# EAGLE design dc-dc_-12V-1A_0_2 (EAGLE 6.1)
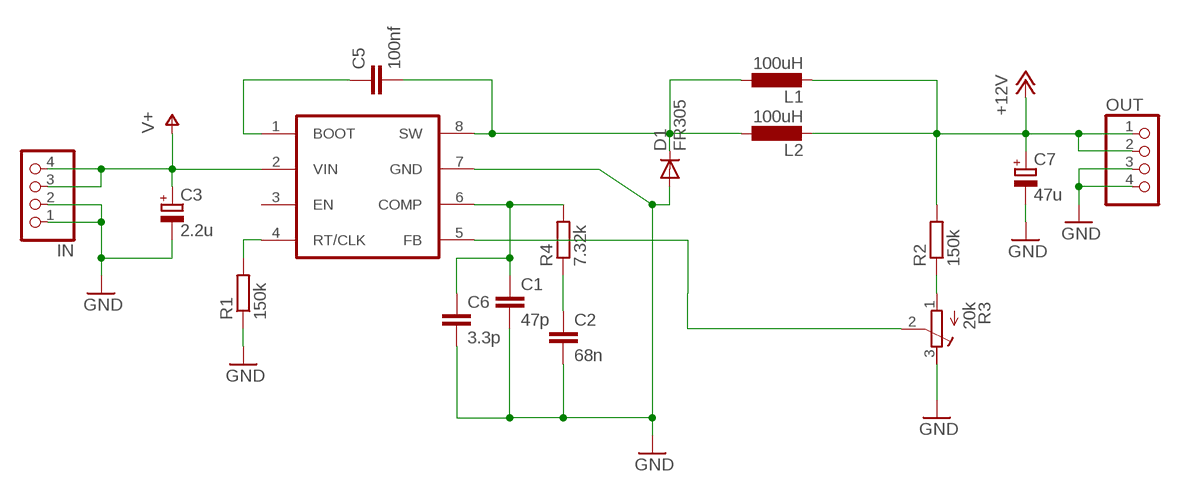
[diagram p0: schematic, sheet 1]

## Parts
C1  47p  C-EUC1206  [C1206]
C2  68n  C-EUC1206  [C1206]
C3  2.2u  CPOL-EUE2-4  [E2-4]
C5  100nf  C-EUC0805  [C0805]
C6  3.3p  C-EUC1206  [C1206]
C7  47u  CPOL-EUE2-4  [E2-4]
D1  FR305  1N5400  [DO201-15]
IN  PINHD-1X4  [1X04]
L1  100uH  RCL_L-EU6000-XXX-RC  [RCL_6000-XXXX-RC]
L2  100uH  RCL_L-EU6000-XXX-RC  [RCL_6000-XXXX-RC]
OUT  PINHD-1X4  [1X04]
R1  150k  R-EU_R0805  [R0805]
R2  150k  R-EU_R0805  [R0805]
R3  20k  R-TRIMM64X  [RTRIM64X]
R4  7.32k  R-EU_0204/5  [0204/5]
U1  TPS54560  [SO08-POWERPAD]

## Nets
+12V: C7.+ L1.2 L2.2 OUT.1 OUT.2 R2.2
GND: C1.2 C2.2 C3.- C6.2 C7.- D1.A IN.1 IN.2 OUT.3 OUT.4 R1.1 R3.3(A) U1.7(GND)
N$1: C5.1 U1.1(BOOT)
N$2: C5.2 D1.C L1.1 L2.1 U1.8(SW)
N$3: R2.1 R3.1(E)
N$4: R3.2(S) U1.5(FB)
N$5: C1.1 C6.1 R4.2 U1.6(COMP)
N$6: C2.1 R4.1
N$8: R1.2 U1.4(RT/CLK)
V+: C3.+ IN.3 IN.4 U1.2(VIN)
Unconnected: U1.3(EN)

## Library data of the parts
C1 C2 C5 C6 = rcl:C-EU: CAPACITOR, European symbol
C3 C7 = rcl:CPOL-EU: POLARIZED CAPACITOR, European symbol
D1 = diode:1N5400: DIODE standard rectifier, 3 A, 50 V (Motorola)
IN OUT = pinhead:PINHD-1X4: PIN HEADER
L1 L2 = Hangar:RCL_L-EU: INDUCTOR, European symbol
R1 R2 R4 = rcl:R-EU_: RESISTOR, European symbol
R3 = rcl:R-TRIMM: Trimm resistor
U1 = TPS54560:TPS54560

## Board
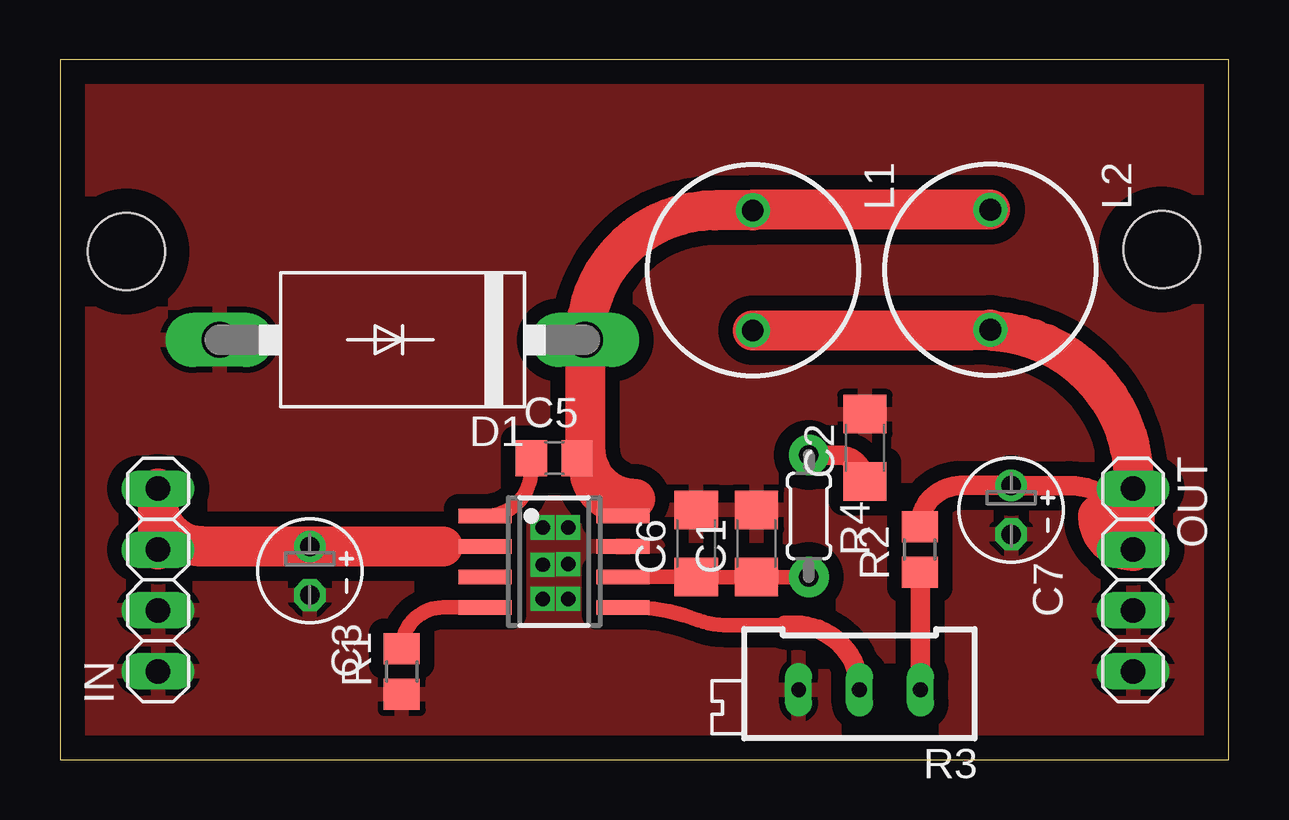
[diagram p1: board, top side]
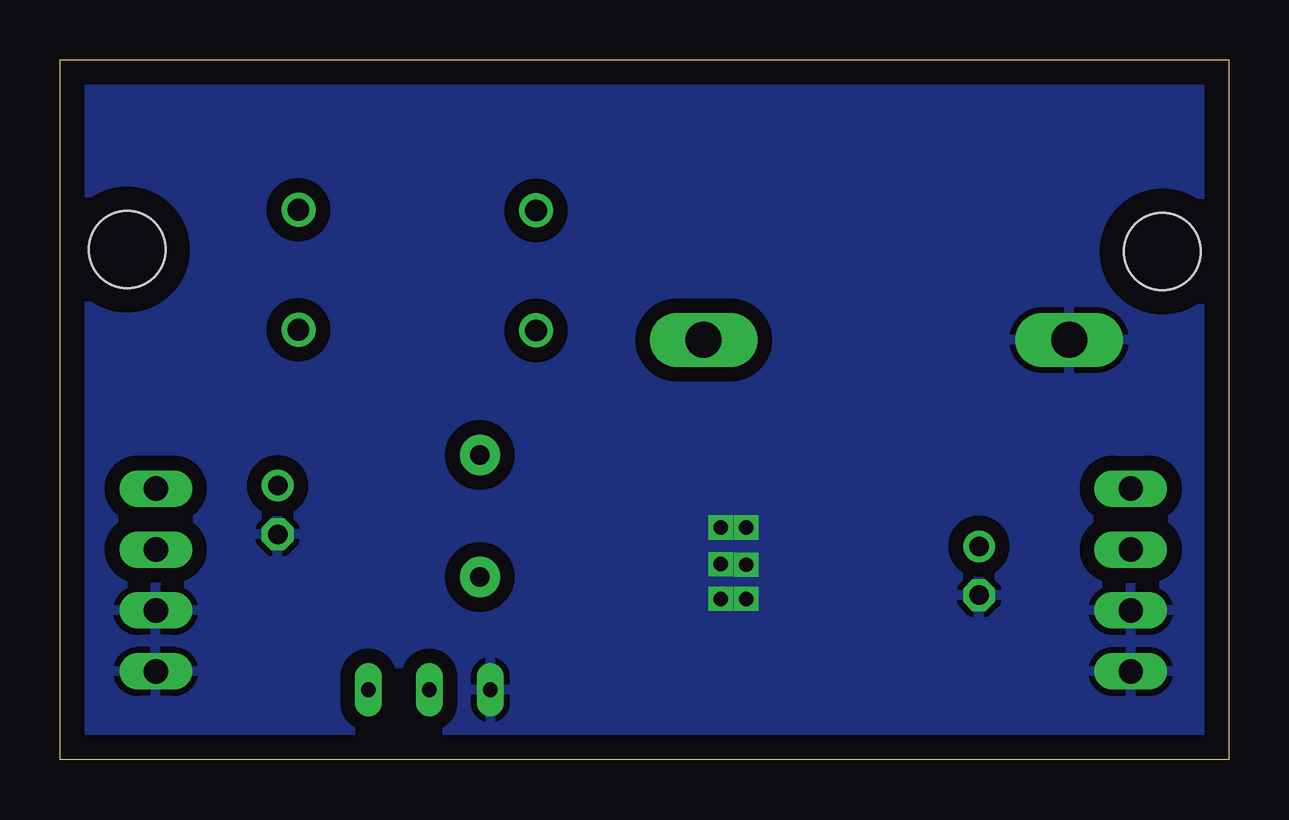
[diagram p2: board, bottom side, seen from below]

Size 48.72 x 29.16 mm. Coordinates in mm from the lower left corner, seen from the top.
Outline: 0,0 48.72,0 48.72,29.16 0,29.16 0,0
Copper layers (1*16): Top 0.035mm / dielectric 1.5mm / Bottom 0.035mm
Design rules: minimum track width 10mil, minimum drill 0.6mm, track to track 8mil, track to pad 8mil, pad to pad 8mil, via to via 8mil, smd to smd 8mil, copper to edge 40mil, drill to drill 8mil, minimum pad ring 10mil, minimum via ring 8mil, stop-mask expansion 4mil, vias tented up to drill 0mil, thermal gap 10mil
Holes 3.2 mm at 2.77,21.18 45.92,21.26

### Footprints (pad centres in the part's own frame; a part is rotated, then mirrored left to right if it is on the bottom)
C1206 = smd 1.6 x 1.8: 1 -1.4,0; 2 1.4,0
E2-4 = drill 0.813 pad 1.27: + -1.016,0 | drill 0.813 pad 1.27 octagon: - 1.016,0
C0805 = smd 1.3 x 1.5: 1 -0.95,0; 2 0.95,0
DO201-15 = drill 1.499 long: A 7.62,0; C -7.62,0
1X04 = drill 1.016 long: 1 -3.81,0; 2 -1.27,0; 3 1.27,0; 4 3.81,0
RCL_6000-XXXX-RC = drill 0.9 pad 1.422: 1 -2.5,0; 2 2.5,0
R0805 = smd 1.3 x 1.5: 1 -0.95,0; 2 0.95,0
RTRIM64X = drill 0.61 long: 1 0,-2.54; 2 0,0; 3 0,2.54
0204/5 = drill 0.813 pad 1.676: 1 -2.54,0; 2 2.54,0
SO08-POWERPAD = smd 0.6 x 2.2: 1 -1.905,-2.875; 2 -0.635,-2.875; 3 0.635,-2.875; 4 1.905,-2.875; 5 1.905,2.875; 6 0.635,2.875; 7 -0.635,2.875; 8 -1.905,2.875

### Placement (x,y rotation side)
C1  29.03,9.02 90 top
C2  33.55,13 90 top
C3  10.41,7.87 270 top
C5  20.6,12.57 0 top
C6  26.52,9.02 90 top
C7  39.65,10.41 270 top
D1  14.27,17.5 180 top
IN  4.09,7.49 90 top
L1  28.88,20.4 270 top
L2  38.78,20.42 270 top
OUT  44.73,7.49 270 top
R1  14.25,3.68 90 top
R2  35.84,8.76 90 top
R3  33.32,2.92 90 top
R4  31.22,10.16 270 top
U1  20.6,8.25 270 top

### Tracks (layer width: path | path; a pad name or v marks a point on that pad's centre or on a via)
+12V
  Top 0.813: R2.2 arc-90 37.56,11.43 C7.+ arc-90 C7.+ 42.06,11.43 arc-90 OUT.2
  Top 1.676: L1.2 37.95,17.9 L2.2 38.9,17.87 arc-90 OUT.1
  Top 1.778: OUT.1 OUT.2 arc-90 43.33,10.16
GND  (via drill 0.6)
  other vias: 20.12,6.71 20.12,9.68 21.18,9.68 21.18,8.15 20.12,8.13 21.18,6.71
  pour Bottom (isolate 0.61): -0.99,37.97 49.81,37.97 49.81,-2.67 -0.99,-2.67
  pour Top (isolate 0.61): -2.26,39.24 51.08,39.24 51.08,-3.94 -2.26,-3.94
N$1
  Top 0.61: U1.1 arc90 19.65,12.08 C5.1
N$2
  Top 0.406: U1.8 23.47,10.37 arc-90 23.98,10.87
  Top 0.61: U1.8 arc-90 21.55,12.08 C5.2
  Top 1.676: L2.1 28.91,22.92 arc90 L1.1 27.29,22.9 arc90 D1.C 21.89,12.95 arc90 23.98,10.87
N$3
  Top 0.813: 35.89,7.76 arc90 R2.1 arc-90 35.86,7.79 R3.1
N$4
  Top 0.61: U1.5 arc-24 26.62,5.82 arc22 27.69,5.61 30.23,5.61
  Top 0.813: 30.23,5.61 30.63,5.61 arc-90 R3.2
N$5
  Top 0.61: U1.6 C6.1 arc-90 C6.1 C1.1 R4.2 arc90 R4.2
N$6
  Top 0.813: R4.1 32.46,12.7 arc-90 C2.1
N$8
  Top 0.61: U1.4 15.97,6.35 arc90 R1.2
V+
  Top 0.61: U1.2 15.95,8.89
  Top 1.676: IN.3 4.09,10.67 | 4.09,10.67 IN.4 | 4.09,10.67 arc90 5.99,8.89 C3.+ 15.95,8.89